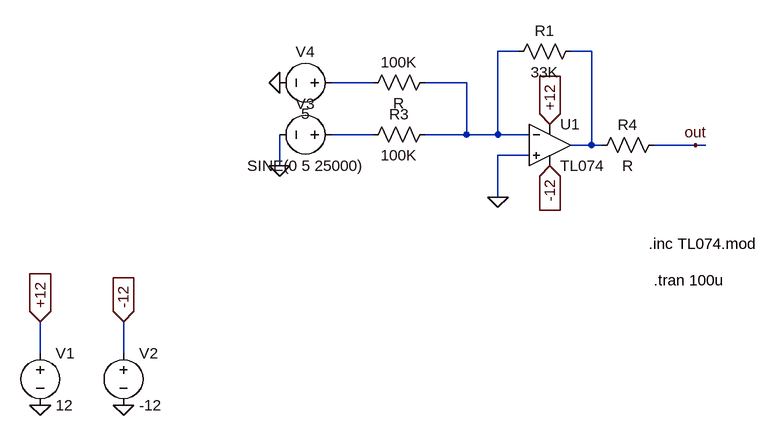
[diagram p0: schematic Draft1.asc]
Draft1.asc, the LTspice schematic file:
Version 4
SHEET 1 932 784
WIRE 400 224 368 224
WIRE 512 224 480 224
WIRE 176 272 112 272
WIRE 320 272 256 272
WIRE 176 352 112 352
WIRE 320 352 320 272
WIRE 320 352 256 352
WIRE 368 352 368 224
WIRE 368 352 320 352
WIRE 416 352 368 352
WIRE 512 368 512 224
WIRE 512 368 480 368
WIRE 528 368 512 368
WIRE 672 368 608 368
WIRE 688 368 672 368
WIRE 416 384 368 384
WIRE 32 400 32 352
WIRE 368 448 368 384
WIRE -336 688 -336 640
WIRE -208 688 -208 640
FLAG -336 768 0
FLAG -208 768 0
FLAG -336 640 +12
IOPIN -336 640 In
FLAG -208 640 -12
IOPIN -208 640 In
FLAG 448 400 -12
IOPIN 448 400 In
FLAG 448 336 +12
IOPIN 448 336 In
FLAG 368 448 0
FLAG 32 400 0
FLAG 32 272 0
FLAG 672 368 out
SYMBOL Opamps/opamp2 448 304 R0
SYMATTR InstName U1
SYMATTR Value TL074
SYMBOL voltage -336 672 R0
SYMATTR InstName V1
SYMATTR Value 12
SYMBOL voltage -208 672 R0
SYMATTR InstName V2
SYMATTR Value -12
SYMBOL res 384 240 R270
WINDOW 0 32 56 VTop 2
WINDOW 3 0 56 VBottom 2
SYMATTR InstName R1
SYMATTR Value 33K
SYMBOL res 160 288 R270
WINDOW 0 32 56 VTop 2
WINDOW 3 0 56 VBottom 2
SYMATTR InstName 100K
SYMBOL res 272 336 R90
WINDOW 0 0 56 VBottom 2
WINDOW 3 32 56 VTop 2
SYMATTR InstName R3
SYMATTR Value 100K
SYMBOL res 624 352 R90
WINDOW 0 0 56 VBottom 2
WINDOW 3 32 56 VTop 2
SYMATTR InstName R4
SYMBOL voltage 128 352 R90
WINDOW 0 -32 56 VBottom 2
WINDOW 3 32 56 VTop 2
SYMATTR InstName V3
SYMATTR Value SINE(0 5 25000)
SYMATTR Value2 AC 11
SYMBOL voltage 128 272 R90
WINDOW 0 -32 56 VBottom 2
WINDOW 3 32 56 VTop 2
SYMATTR InstName V4
SYMATTR Value 5
TEXT 600 520 Left 2 !.inc TL074.mod
TEXT 608 576 Left 2 !.tran 100u

The netlist it stands for:
* Draft1.asc
XU1 0 N001 +12 -12 N002 TL074  ; pins In+ In- V+ V- OUT
V1 +12 0 12
V2 -12 0 -12
R1 N001 N002 33K
R§100K N003 N001 R
R3 N001 N004 100K
R4 out N002 R
V3 N004 0 SINE(0 5 25000) AC 11
V4 N003 0 5
.inc TL074.mod
.tran 100u
.backanno
.end